# Altium schematic sheet ADC_part1.SchDoc
size A4
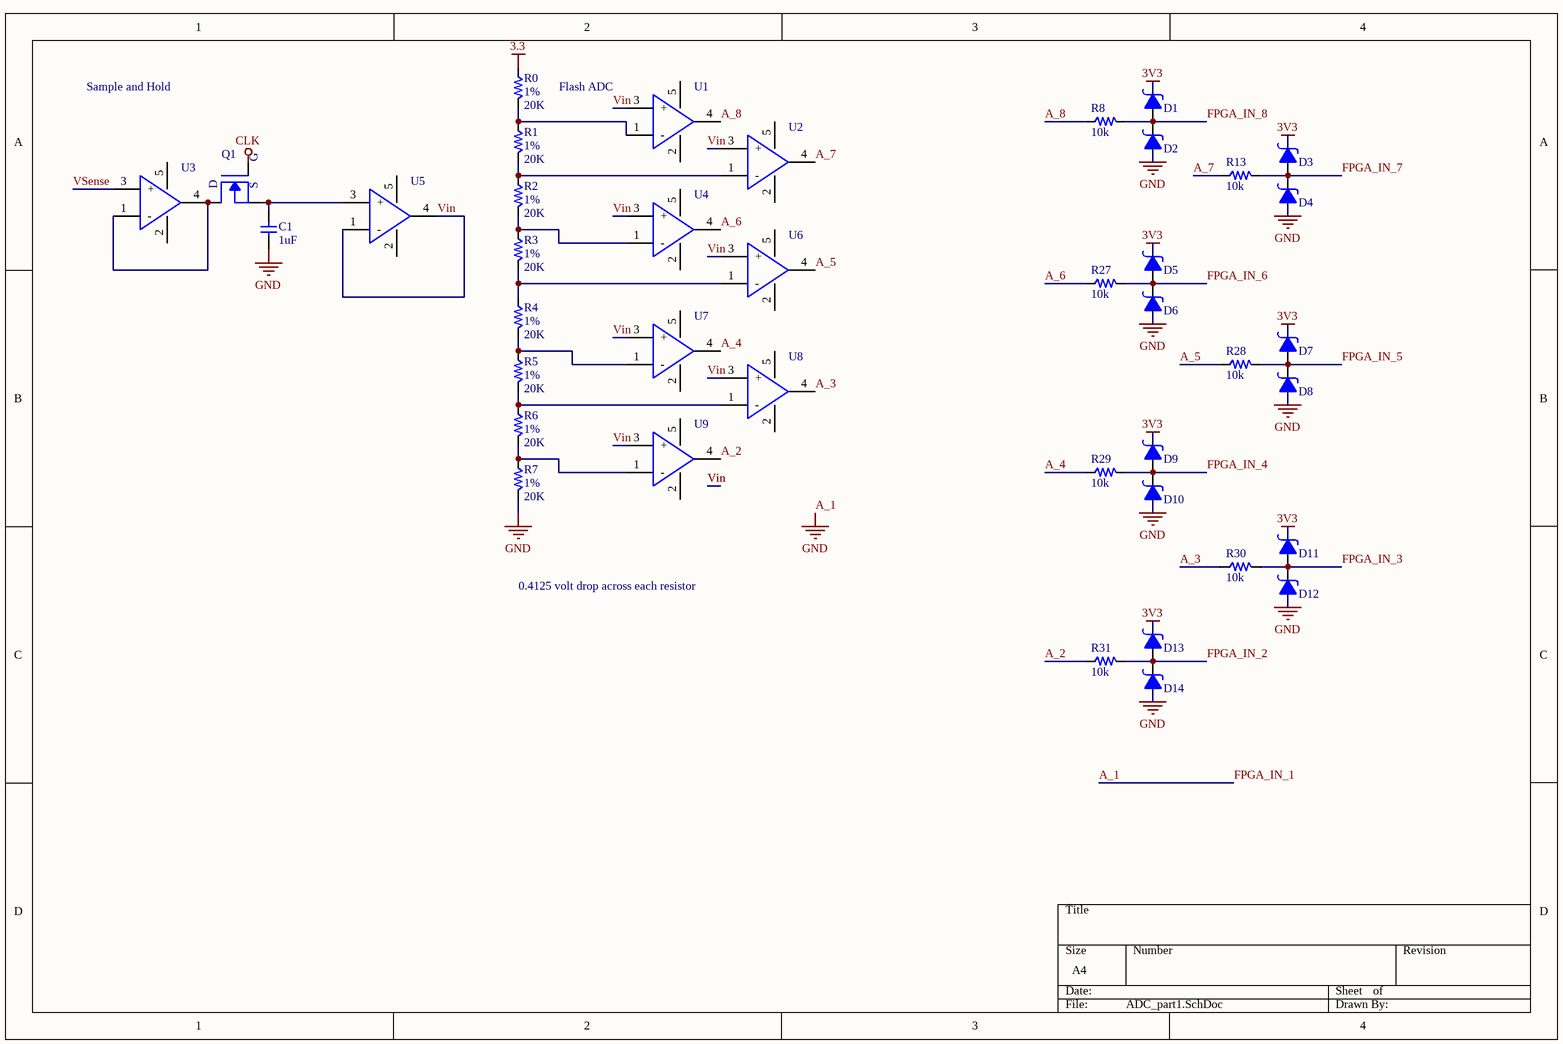
[diagram p0: ADC_part1.SchDoc]

## Parts
C1  value 1uF  [PCB_GENERIC_SMD_0603]  (hidden comment: C060-0001U-00)
D1  ONSEMI_MBRM110LT1G  [ON Semi Schottky Diode - MBRM110LT1G]  (value not drawn)
D2  ONSEMI_MBRM110LT1G  [ON Semi Schottky Diode - MBRM110LT1G]  (value not drawn)
D3  ONSEMI_MBRM110LT1G  [ON Semi Schottky Diode - MBRM110LT1G]  (value not drawn)
D4  ONSEMI_MBRM110LT1G  [ON Semi Schottky Diode - MBRM110LT1G]  (value not drawn)
D5  ONSEMI_MBRM110LT1G  [ON Semi Schottky Diode - MBRM110LT1G]  (value not drawn)
D6  ONSEMI_MBRM110LT1G  [ON Semi Schottky Diode - MBRM110LT1G]  (value not drawn)
D7  ONSEMI_MBRM110LT1G  [ON Semi Schottky Diode - MBRM110LT1G]  (value not drawn)
D8  ONSEMI_MBRM110LT1G  [ON Semi Schottky Diode - MBRM110LT1G]  (value not drawn)
D9  ONSEMI_MBRM110LT1G  [ON Semi Schottky Diode - MBRM110LT1G]  (value not drawn)
D10  ONSEMI_MBRM110LT1G  [ON Semi Schottky Diode - MBRM110LT1G]  (value not drawn)
D11  ONSEMI_MBRM110LT1G  [ON Semi Schottky Diode - MBRM110LT1G]  (value not drawn)
D12  ONSEMI_MBRM110LT1G  [ON Semi Schottky Diode - MBRM110LT1G]  (value not drawn)
D13  ONSEMI_MBRM110LT1G  [ON Semi Schottky Diode - MBRM110LT1G]  (value not drawn)
D14  ONSEMI_MBRM110LT1G  [ON Semi Schottky Diode - MBRM110LT1G]  (value not drawn)
Q1  NMOS - SSM3K333R  [NMOS - SSM3K333R - SOTFL95P180X88-3M]  (value not drawn)
R0  value 20K  Tolerance: 1%  [PCB_GENERIC_SMD_0603]  (hidden comment: R060-00103-01)
R1  value 20K  Tolerance: 1%  [PCB_GENERIC_SMD_0603]  (hidden comment: R060-00103-01)
R2  value 20K  Tolerance: 1%  [PCB_GENERIC_SMD_0603]  (hidden comment: R060-00103-01)
R3  value 20K  Tolerance: 1%  [PCB_GENERIC_SMD_0603]  (hidden comment: R060-00103-01)
R4  value 20K  Tolerance: 1%  [PCB_GENERIC_SMD_0603]  (hidden comment: R060-00103-01)
R5  value 20K  Tolerance: 1%  [PCB_GENERIC_SMD_0603]  (hidden comment: R060-00103-01)
R6  value 20K  Tolerance: 1%  [PCB_GENERIC_SMD_0603]  (hidden comment: R060-00103-01)
R7  value 20K  Tolerance: 1%  [PCB_GENERIC_SMD_0603]  (hidden comment: R060-00103-01)
R8  value 10k  [PCB_GENERIC_SMD_0603]  (hidden comment: R060-00101-05)
R13  value 10k  [PCB_GENERIC_SMD_0603]  (hidden comment: R060-00101-05)
R27  value 10k  [PCB_GENERIC_SMD_0603]  (hidden comment: R060-00101-05)
R28  value 10k  [PCB_GENERIC_SMD_0603]  (hidden comment: R060-00101-05)
R29  value 10k  [PCB_GENERIC_SMD_0603]  (hidden comment: R060-00101-05)
R30  value 10k  [PCB_GENERIC_SMD_0603]  (hidden comment: R060-00101-05)
R31  value 10k  [PCB_GENERIC_SMD_0603]  (hidden comment: R060-00101-05)
U1  AP331A  [SOT95P285X130-5N]  (value not drawn)
U2  AP331A  [SOT95P285X130-5N]  (value not drawn)
U3  AP331A  [SOT95P285X130-5N]  (value not drawn)
U4  AP331A  [SOT95P285X130-5N]  (value not drawn)
U5  AP331A  [SOT95P285X130-5N]  (value not drawn)
U6  AP331A  [SOT95P285X130-5N]  (value not drawn)
U7  AP331A  [SOT95P285X130-5N]  (value not drawn)
U8  AP331A  [SOT95P285X130-5N]  (value not drawn)
U9  AP331A  [SOT95P285X130-5N]  (value not drawn)

## Nets
3.3: R0.1
3V3: D1.1 D3.1 D5.1 D7.1 D9.1 D11.1 D13.1
A_1: C1.1 D2.2 D4.2 D6.2 D8.2 D10.2 D12.2 D14.2 R7.2  [also labelled FPGA_IN_1, GND]
CLK: Q1.1(G)
A_2: R31.1 U9.4(VOUT)
A_3: R30.1 U8.4(VOUT)
A_4: R29.1 U7.4(VOUT)
A_5: R28.1 U6.4(VOUT)
A_6: R27.1 U4.4(VOUT)
A_7: R13.1 U2.4(VOUT)
A_8: R8.1 U1.4(VOUT)
FPGA_IN_2: D13.2 D14.1 R31.2
FPGA_IN_3: D11.2 D12.1 R30.2
FPGA_IN_4: D9.2 D10.1 R29.2
FPGA_IN_5: D7.2 D8.1 R28.2
FPGA_IN_6: D5.2 D6.1 R27.2
FPGA_IN_7: D3.2 D4.1 R13.2
FPGA_IN_8: D1.2 D2.1 R8.2
Vin: U1.3(+) U2.3(+) U4.3(+) U5.1(-) U5.4(VOUT) U6.3(+) U7.3(+) U8.3(+) U9.3(+)
VSense: U3.3(+)
NetC1_2: C1.2 Q1.2(S) U5.3(+)
NetQ1_3: Q1.3(D) U3.1(-) U3.4(VOUT)
NetR0_2: R0.2 R1.1 U1.1(-)
NetR1_2: R1.2 R2.1 U2.1(-)
NetR2_2: R2.2 R3.1 U4.1(-)
NetR3_2: R3.2 R4.1 U6.1(-)
NetR4_2: R4.2 R5.1 U7.1(-)
NetR5_2: R5.2 R6.1 U8.1(-)
NetR6_2: R6.2 R7.1 U9.1(-)

Not connected (* = marked no-connect by the designer): U1 2(GND) 5(VCC); U2 2(GND) 5(VCC); U3 2(GND) 5(VCC); U4 2(GND) 5(VCC); U5 2(GND) 5(VCC); U6 2(GND) 5(VCC); U7 2(GND) 5(VCC); U8 2(GND) 5(VCC); U9 2(GND) 5(VCC)

## Notes on the sheet
- Sample and Hold
- Flash ADC
- 0.4125 volt drop across each resistor

## Library data of the parts
C1 = C060-0001U-00: CAP CER 0603 1uF 16V X5R 20%; Tolerance: 20%; Voltage: 16V; Package: 0603
D1-D14 = ONSEMI_MBRM110LT1G: DIODE SCHOTTKY 10V 1A; Supplier 1: Digi-Key; Supplier Part Number 1: MBRM110LT1GOSDKR-ND
Q1 = NMOS - SSM3K333R: MOSFET N CH 30V 6A 2-3Z1A; Supplier 1: Digi-Key; Supplier Part Number 1: SSM3K333RLFDKR-ND
R0-R7 = R060-00103-01: RES 0603 10K 1% 100mW; Power: 100mW; Package: 0603
R8 R13 R27-R31 = R060-00101-05: RES 0603 100ohm 5% 63mW; Tolerance: 5%; Power: 63mW; Package: 0603
U1-U9 = AP331A: Single Channel Comparator, Open Drain, SC-74A/SOT-753; Supplier 1: Digikey; Supplier Part Number 1: AP331AWGDICT-ND